# EAGLE design PCE (EAGLE 7.7.0)
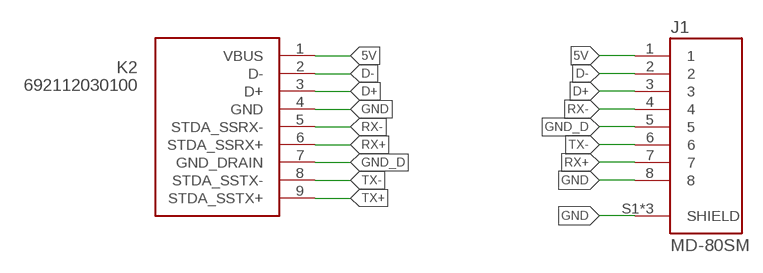
[diagram p0: schematic, sheet 1]

## Parts
J1  MD-80SM  [CUI_MD-80SM]
K2  692112030100  [692112030100]

## Nets
5V: J1.1 K2.1(VBUS)
D+: J1.3 K2.3(D+)
D-: J1.2 K2.2(D-)
GND: J1.8 J1.S1(SHIELD) J1.S2(SHIELD) J1.S3(SHIELD) K2.4(GND)
GND_D: J1.5 K2.7(GND_DRAIN)
RX+: J1.7 K2.6(STDA_SSRX+)
RX-: J1.4 K2.5(STDA_SSRX-)
TX+: K2.9(STDA_SSTX+)
TX-: J1.6 K2.8(STDA_SSTX-)

## Library data of the parts
J1 = MD-80SM-edit:MD-80SM: MD-XXSM Series 8 Pin Female Right Angle Shielded Side Mini DIN Connector; CUI_PURCHASE_URL: https://www.cui.com/product/interconnect/connectors/din-connectors/md-sm-series?utm_source=snapeda.com&utm_medium=referral&utm_campaign=snapedaBOM; DESCRIPTION: 3~9 Positions, Receptacle, Right Angle, Through Hole, Shielded, Mini Circular DIN Connector; DIGI-KEY_PART_NUMBER: CP-2280-ND; DIGI-KEY_PURCHASE_URL: https://www.digikey.com/product-detail/en/cui-inc/MD-80SM/CP-2280-ND/96944?utm_source=snapeda&utm_medium=aggregator&utm_campaign=symbol; MF: CUI Inc.; MP: MD-80SM; PACKAGE: None
K2 = Wuerth_Elektronik_eiCan_Communication_Connectors_STENCIL:692112030100: WR-COM USB 3.0 SMT PLUG WITH CLIPTYPE A

## Board
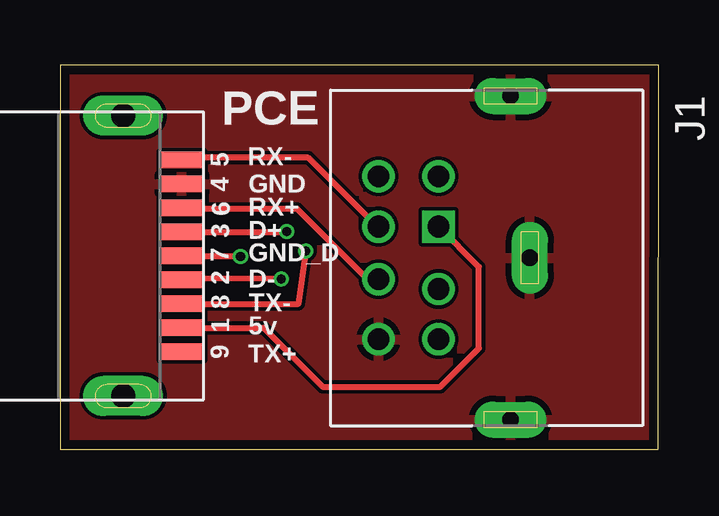
[diagram p1: board, top side]
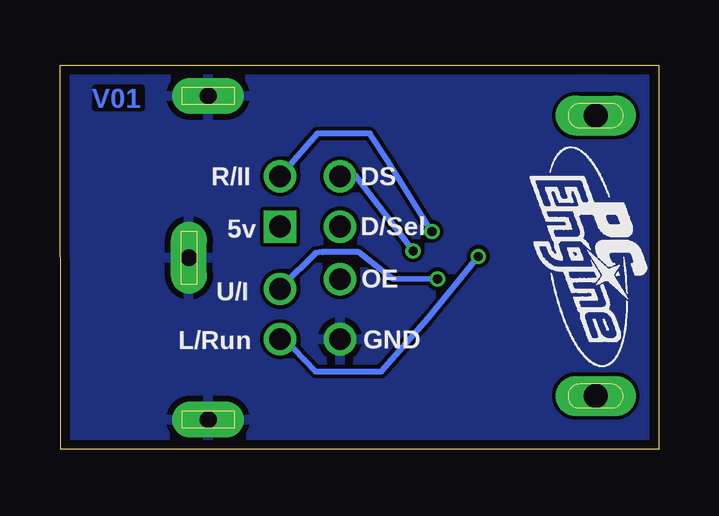
[diagram p2: board, bottom side, seen from below]

Size 24.95 x 16.03 mm. Coordinates in mm from the lower left corner, seen from the top.
Outline: 0,0 24.92,0 24.95,16.03 0,16.03 0,0
Copper layers (1*16): Top 0.035559375mm / dielectric 1.6mm / Bottom 0.035559375mm
Design rules "oshpark-2layer": minimum track width 6mil, minimum drill 10mil, track to track 6mil, track to pad 6mil, pad to pad 6mil, via to via 6mil, smd to smd 6mil, copper to edge 15mil, drill to drill 6mil, minimum pad ring 5mil, minimum via ring 5mil, stop-mask expansion 2.5mil, vias tented up to drill 0mil, thermal gap 10mil

### Footprints (pad centres in the part's own frame; a part is rotated, then mirrored left to right if it is on the bottom)
CUI_MD-80SM = drill 0.9 square: 1 0,0 | drill 0.9: 2 2.6,0; 3 -2.1,0; 4 0,-2.5; 5 4.7,0; 6 -2.1,-2.5; 7 2.2,-2.5; 8 4.7,-2.5 | drill 0.7 pad 1.5 long: S1 -5.45,3; S2 8.05,3; S3 1.3,3.8
692112030100 = smd 0.7 x 1.8: 1 -3,0; 2 -1,0; 3 1,0; 4 3,0; 5 4,0; 6 2,0; 7 0,0; 8 -2,0; 9 -4,0 | drill 1 pad 1.676 long: Z1 5.85,2.45; Z2 -5.85,2.45

### Placement (x,y rotation side)
J1  15.77,9.3 270 top
K2  5.08,8.08 90 top

### Tracks (layer width: path | path; a pad name or v marks a point on that pad's centre or on a via)
5V
  Top 0.254: K2.1 8.49,5.08 10.95,2.62 15.85,2.62 17.45,4.22 17.45,7.62 J1.1
D+  (via drill 0.38)
  Top 0.254: K2.3 9.43,9.08 v9.45,9.09
  Bottom 0.254: v9.45,9.09 11.28,12.01 12.04,13.18 14.22,13.18 J1.3
D-  (via drill 0.38)
  Top 0.152: 5.16,7.14 K2.2
  Top 0.254: v9.22,7.11 5.16,7.14
  Bottom 0.254: v9.22,7.11 11.1,7.14 12.5,8.23 14.02,8.23 14.3,8.2 15.67,6.83 J1.2
GND
  pour Bottom: 0.25,15.82 24.66,15.88 24.84,0.2 0.15,-0.03
  pour Top: 0.2,15.85 24.64,15.82 24.82,0.25 0.1,0
GND_D  (via drill 0.38)
  Top 0.152: 5.16,8.05 K2.7
  Top 0.254: v7.52,8.05 5.16,8.05
  Bottom 0.254: v7.52,8.05 9.6,5.49 11.56,3.25 14.3,3.25 15.67,4.7 J1.5
RX+
  Top 0.152: 5.16,10.03 K2.6
  Top 0.254: 5.16,10.03 9.88,10.03 12.78,7.14 13.23,7.14 J1.7
RX-
  Top 0.152: 5.16,12.17 K2.5
  Top 0.254: 5.16,12.17 10.34,12.17 13.23,9.27 J1.4
TX-  (via drill 0.38)
  Top 0.152: 5.16,6.07 K2.8
  Top 0.254: 5.16,6.07 9.93,6.07 v10.24,8.28
  Bottom 0.152: 12.62,11.4 13.23,11.4 J1.6
  Bottom 0.254: 12.62,11.4 v10.24,8.28

### Text on the board
Bottom: V01
tPlace: PCE | 5 | RX- | 4 | GND | 6 | RX+ | 3 | D+ | 7 | GND_D | 2 | D- | 8 | TX- | 1 | 5v | 9 | TX+
bPlace: DS | R/II | D/Sel | 5v | OE | U/I | GND | L/Run